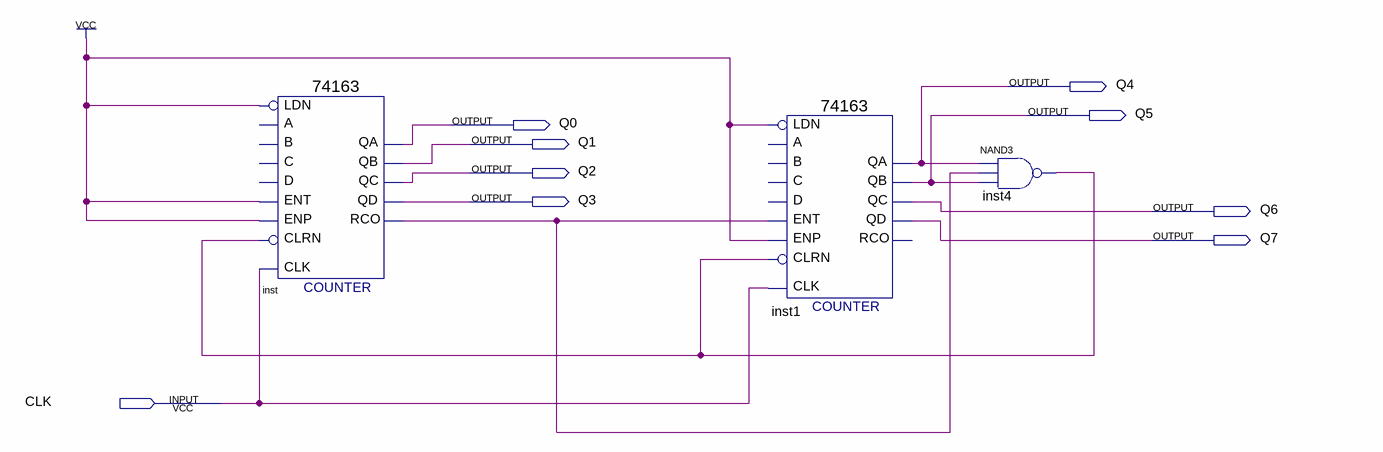
[diagram p0: schematic sheet]
// Quartus schematic SpecialCount9.bdf as structural Verilog: 3 symbols, 9 pins
module SpecialCount9 (
  input  CLK,
  output Q4,
  output Q5,
  output Q0,
  output Q1,
  output Q2,
  output Q3,
  output Q6,
  output Q7
);

  wire inst4_out, inst_rco;

  \74163  inst (
    .ENT(1'b1), .CLRN(inst4_out), .CLK(CLK), .ENP(1'b1), .LDN(1'b1), .QA(Q0), .QB(Q1), .QC(Q2), .QD(Q3),
    .RCO(inst_rco));  // open: C, B, A, D
  \74163  inst1 (
    .ENT(inst_rco), .CLRN(inst4_out), .CLK(CLK), .ENP(1'b1), .LDN(1'b1), .QA(Q4), .QB(Q5), .QC(Q6), .QD(Q7));  // open: C, B, A, D, RCO
  nand inst4 (inst4_out, Q4, inst_rco, Q5);
endmodule
